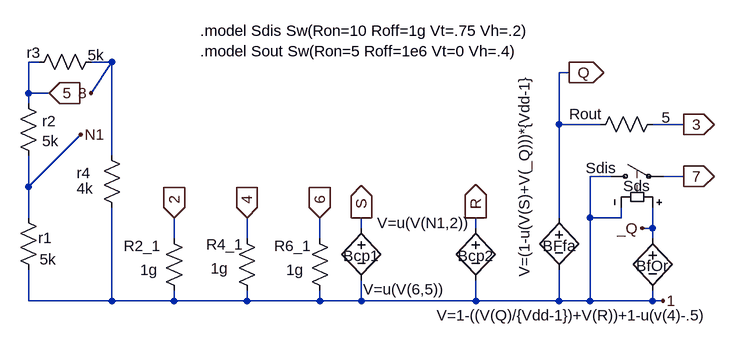
[diagram p0: schematic 4B&1Sw555.asc]
4B&1Sw555.asc, the LTspice schematic file:
Version 4
SHEET 1 1704 916
WIRE -576 304 -576 256
WIRE -576 320 -576 304
WIRE -576 448 -576 400
WIRE -576 496 -576 448
WIRE -576 624 -576 576
WIRE -560 256 -576 256
WIRE -544 304 -576 304
WIRE -496 368 -576 448
WIRE -448 256 -480 256
WIRE -448 256 -480 304
WIRE -448 400 -448 256
WIRE -448 624 -576 624
WIRE -448 624 -448 480
WIRE -352 528 -352 496
WIRE -352 624 -448 624
WIRE -352 624 -352 608
WIRE -240 528 -240 496
WIRE -240 624 -352 624
WIRE -240 624 -240 608
WIRE -128 528 -128 496
WIRE -128 624 -240 624
WIRE -128 624 -128 608
WIRE -64 512 -64 496
WIRE -64 624 -128 624
WIRE -64 624 -64 592
WIRE 112 512 112 496
WIRE 112 624 -64 624
WIRE 112 624 112 592
WIRE 240 352 240 272
WIRE 240 496 240 352
WIRE 240 624 112 624
WIRE 240 624 240 576
WIRE 256 272 240 272
WIRE 288 496 288 432
WIRE 288 624 240 624
WIRE 288 624 288 496
WIRE 304 352 240 352
WIRE 320 432 288 432
WIRE 336 496 288 496
WIRE 336 496 336 480
WIRE 384 512 368 512
WIRE 384 512 384 480
WIRE 384 528 384 512
WIRE 384 624 288 624
WIRE 384 624 384 608
WIRE 400 624 384 624
WIRE 432 352 384 352
WIRE 432 432 400 432
FLAG -496 368 N1
FLAG -544 304 5
IOPIN -544 304 In
FLAG 432 432 7
IOPIN 432 432 Out
FLAG 368 512 _Q
FLAG -480 304 8
FLAG 432 352 3
IOPIN 432 352 Out
FLAG 400 624 1
FLAG -240 496 4
IOPIN -240 496 In
FLAG -128 496 6
IOPIN -128 496 In
FLAG -64 496 S
IOPIN -64 496 Out
FLAG -352 496 2
IOPIN -352 496 In
FLAG 112 496 R
IOPIN 112 496 Out
FLAG 256 272 Q
IOPIN 256 272 Out
SYMBOL res -592 480 R0
WINDOW 0 31 47 Left 0
WINDOW 3 33 80 Left 0
SYMATTR InstName r1
SYMATTR Value 5k
SYMBOL res -592 304 R0
WINDOW 0 37 43 Left 0
WINDOW 3 37 74 Left 0
SYMATTR InstName r2
SYMATTR Value 5k
SYMBOL res -464 240 R90
WINDOW 0 17 104 VBottom 0
WINDOW 3 -10 8 VTop 0
SYMATTR InstName r3
SYMATTR Value 5k
SYMBOL sw 304 432 R270
WINDOW 0 -15 35 VRight 0
WINDOW 3 13 -23 VRight 0
SYMATTR InstName Sds
SYMATTR Value Sdis
SYMBOL res -464 384 R0
WINDOW 0 -38 43 Left 0
WINDOW 3 -38 67 Left 0
SYMATTR InstName r4
SYMATTR Value 4k
SYMBOL res -336 624 R180
WINDOW 0 36 85 Left 0
WINDOW 3 41 48 Left 0
SYMATTR InstName R2_1
SYMATTR Value 1g
SYMBOL bv -64 496 R0
WINDOW 0 -28 59 Left 0
WINDOW 3 129 110 Right 0
SYMATTR InstName Bcp1
SYMATTR Value V=u(V(6,5))
SYMBOL bv 112 496 R0
WINDOW 0 -28 59 Left 0
WINDOW 3 -152 8 Left 0
SYMATTR InstName Bcp2
SYMATTR Value V=u(V(N1,2))
SYMBOL bv 384 512 R0
WINDOW 0 -25 58 Left 0
WINDOW 3 92 134 Right 0
SYMATTR InstName BfOr
SYMATTR Value V=1-((V(Q)/{Vdd-1})+V(R))+1-u(v(4)-.5)
SYMBOL bv 240 480 R0
WINDOW 0 -25 59 Left 0
WINDOW 3 -53 -208 VRight 0
SYMATTR InstName BFfa
SYMATTR Value V=(1-u(V(S)+V(_Q)))*{Vdd-1}
SYMBOL res -144 512 R0
WINDOW 0 4 27 Right 0
WINDOW 3 -36 64 Left 0
SYMATTR InstName R6_1
SYMATTR Value 1g
SYMBOL res -256 512 R0
WINDOW 0 -47 25 Left 0
WINDOW 3 -40 62 Left 0
SYMATTR InstName R4_1
SYMATTR Value 1g
SYMBOL res 400 336 R90
WINDOW 0 16 119 VBottom 0
WINDOW 3 -10 -5 VTop 0
SYMATTR InstName Rout
SYMATTR Value 5
TEXT -312 208 Left 0 !.model Sdis Sw(Ron=10 Roff=1g Vt=.75 Vh=.2)\n.model Sout Sw(Ron=5 Roff=1e6 Vt=0 Vh=.4)

The netlist it stands for:
* 4B&1Sw555.asc
r1 N1 1 5k
r2 5 N1 5k
r3 8 5 5k
Sds 1 7 _Q 1 Sdis
r4 8 1 4k
R2_1 1 2 1g
Bcp1 S 1 V=u(V(6,5))
Bcp2 R 1 V=u(V(N1,2))
BfOr _Q 1 V=1-((V(Q)/{Vdd-1})+V(R))+1-u(v(4)-.5)
BFfa Q 1 V=(1-u(V(S)+V(_Q)))*{Vdd-1}
R6_1 6 1 1g
R4_1 4 1 1g
Rout 3 Q 5
.model Sdis Sw(Ron=10 Roff=1g Vt=.75 Vh=.2)
.model Sout Sw(Ron=5 Roff=1e6 Vt=0 Vh=.4)
.backanno
.end